# EAGLE design 7-keys (EAGLE 9.6.2)
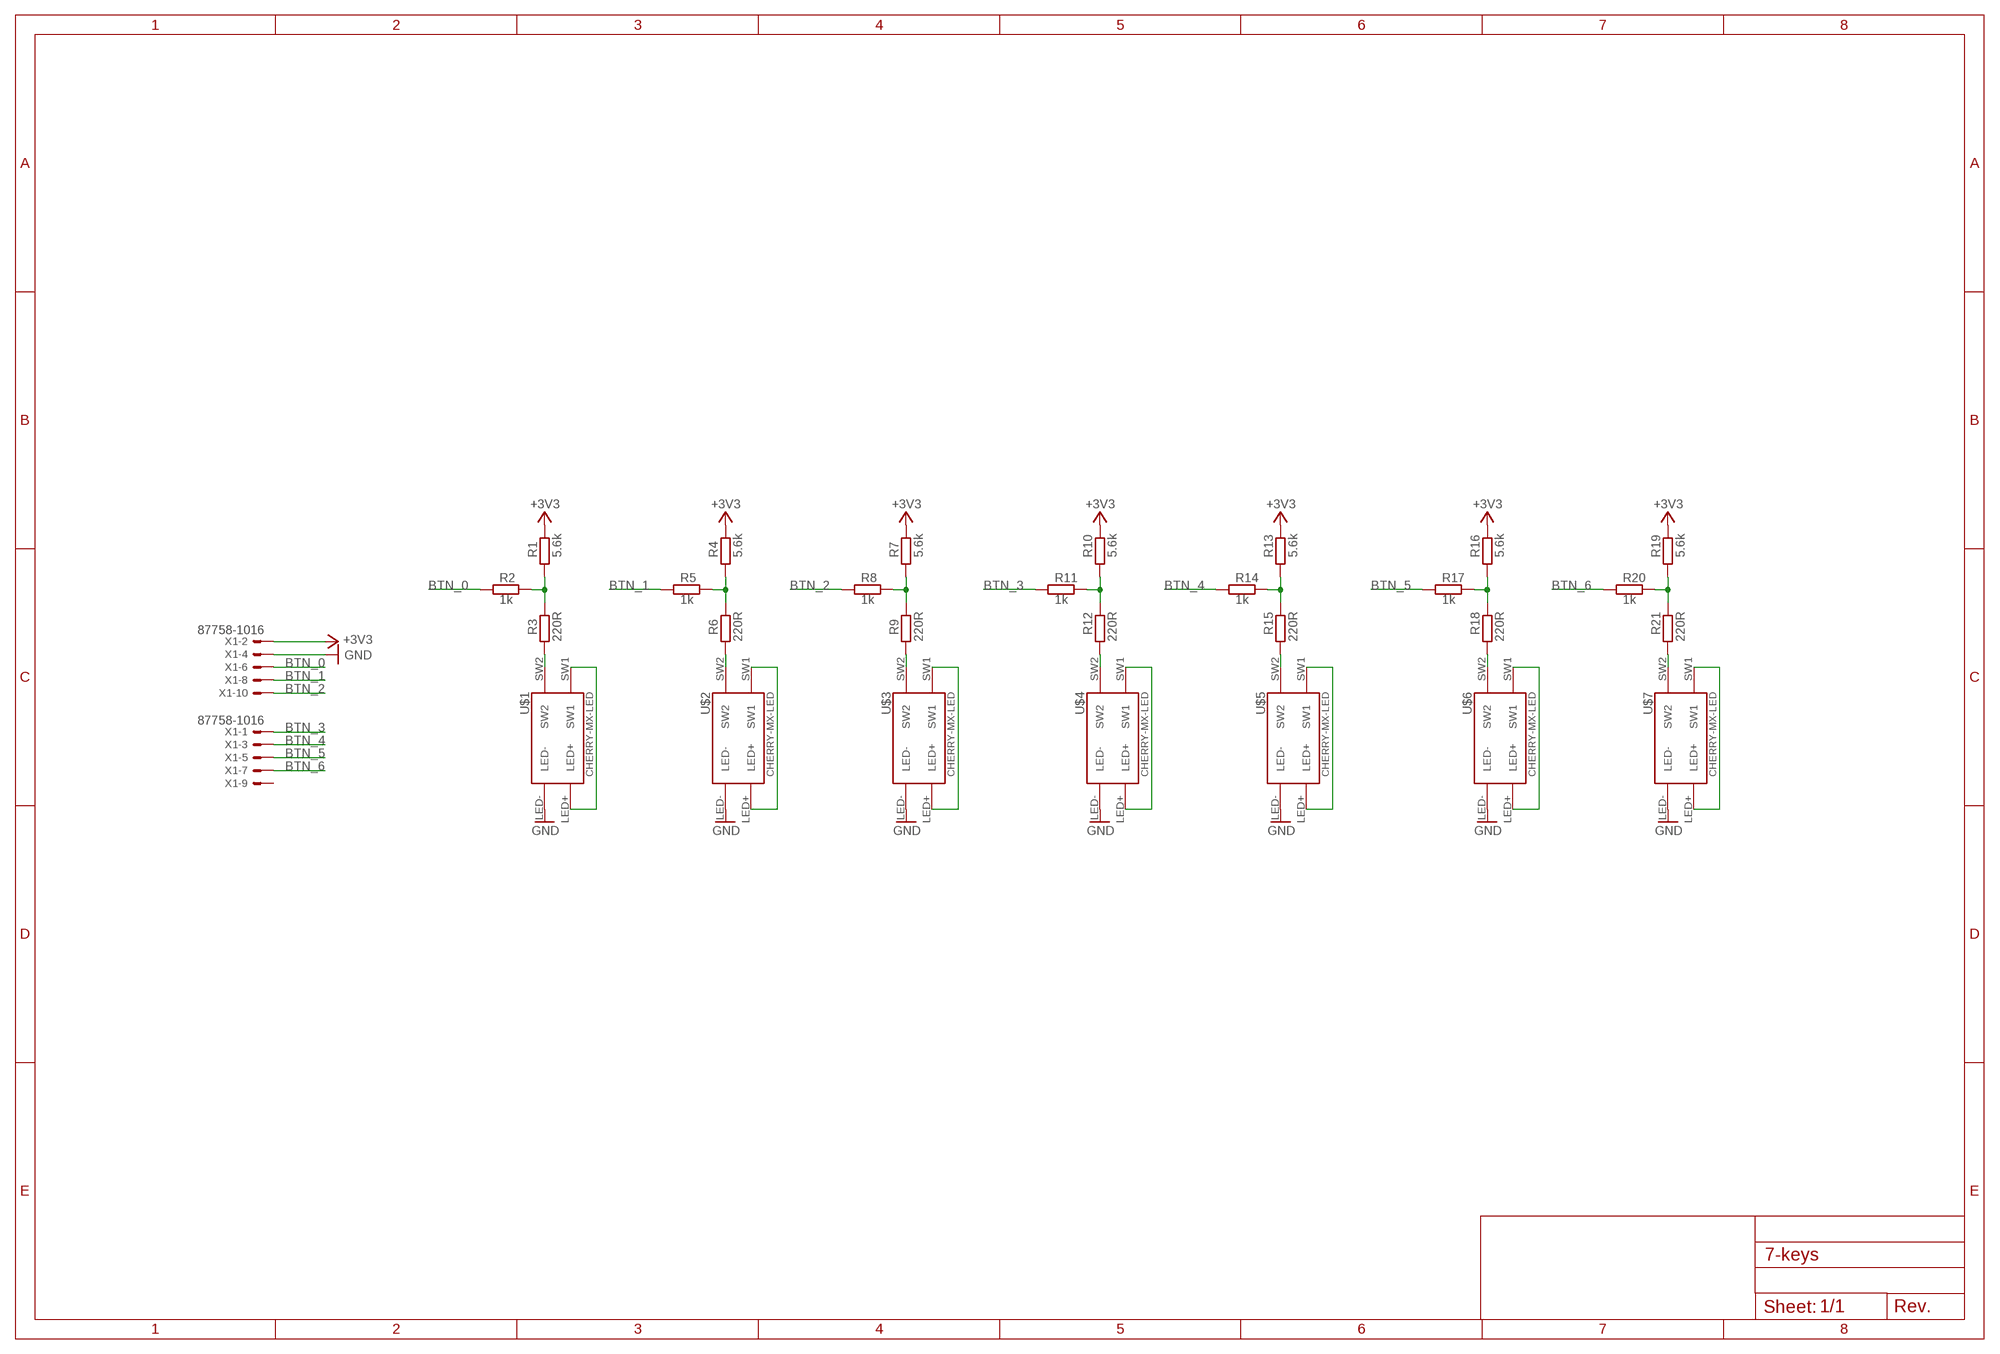
[diagram p0: schematic, sheet 1]

## Parts
R1  5.6k  RESISTOR  [R0603]
R2  1k  RESISTOR  [R0603]
R3  220R  RESISTOR  [R0603]
R4  5.6k  RESISTOR  [R0603]
R5  1k  RESISTOR  [R0603]
R6  220R  RESISTOR  [R0603]
R7  5.6k  RESISTOR  [R0603]
R8  1k  RESISTOR  [R0603]
R9  220R  RESISTOR  [R0603]
R10  5.6k  RESISTOR  [R0603]
R11  1k  RESISTOR  [R0603]
R12  220R  RESISTOR  [R0603]
R13  5.6k  RESISTOR  [R0603]
R14  1k  RESISTOR  [R0603]
R15  220R  RESISTOR  [R0603]
R16  5.6k  RESISTOR  [R0603]
R17  1k  RESISTOR  [R0603]
R18  220R  RESISTOR  [R0603]
R19  5.6k  RESISTOR  [R0603]
R20  1k  RESISTOR  [R0603]
R21  220R  RESISTOR  [R0603]
U$1  CHERRY-MX-LED  [CHERRY-MX-LED]
U$2  CHERRY-MX-LED  [CHERRY-MX-LED]
U$3  CHERRY-MX-LED  [CHERRY-MX-LED]
U$4  CHERRY-MX-LED  [CHERRY-MX-LED]
U$5  CHERRY-MX-LED  [CHERRY-MX-LED]
U$6  CHERRY-MX-LED  [CHERRY-MX-LED]
U$7  CHERRY-MX-LED  [CHERRY-MX-LED]
X1  87758-1016  [87758-1016]

## Nets
+3V3: R1.2 R4.2 R7.2 R10.2 R13.2 R16.2 R19.2 X1.2
BTN_0: R2.1 X1.6
BTN_1: R5.1 X1.8
BTN_2: R8.1 X1.10
BTN_3: R11.1 X1.1
BTN_4: R14.1 X1.3
BTN_5: R17.1 X1.5
BTN_6: R20.1 X1.7
GND: U$1.LED- U$2.LED- U$3.LED- U$4.LED- U$5.LED- U$6.LED- U$7.LED- X1.4
N$1: R1.1 R2.2 R3.2
N$2: R3.1 U$1.SW2
N$3: U$1.LED+ U$1.SW1
N$4: R4.1 R5.2 R6.2
N$5: R6.1 U$2.SW2
N$6: U$2.LED+ U$2.SW1
N$7: R7.1 R8.2 R9.2
N$8: R9.1 U$3.SW2
N$9: U$3.LED+ U$3.SW1
N$10: R10.1 R11.2 R12.2
N$11: R12.1 U$4.SW2
N$12: U$4.LED+ U$4.SW1
N$13: R13.1 R14.2 R15.2
N$14: R15.1 U$5.SW2
N$15: U$5.LED+ U$5.SW1
N$16: R16.1 R17.2 R18.2
N$17: R18.1 U$6.SW2
N$18: U$6.LED+ U$6.SW1
N$19: R19.1 R20.2 R21.2
N$20: R21.1 U$7.SW2
N$21: U$7.LED+ U$7.SW1
Unconnected: X1.9

## Library data of the parts
R1-R21 = lib:RESISTOR
U$1-U$7 = cherrymx:CHERRY-MX-LED: Cherry MX series keyswitch with LED
X1 = lib:87758-1016: 10 Pin - 2mm Dual Row Single Wafer, Vertical T/H HDR Source: http://www.molex.com/pdm_docs/sd/877580616_sd.pdf; MF: MOLEX; MPN: 87758-1016; OC_FARNELL: 7472340; OC_NEWARK: 59J1558

## Board
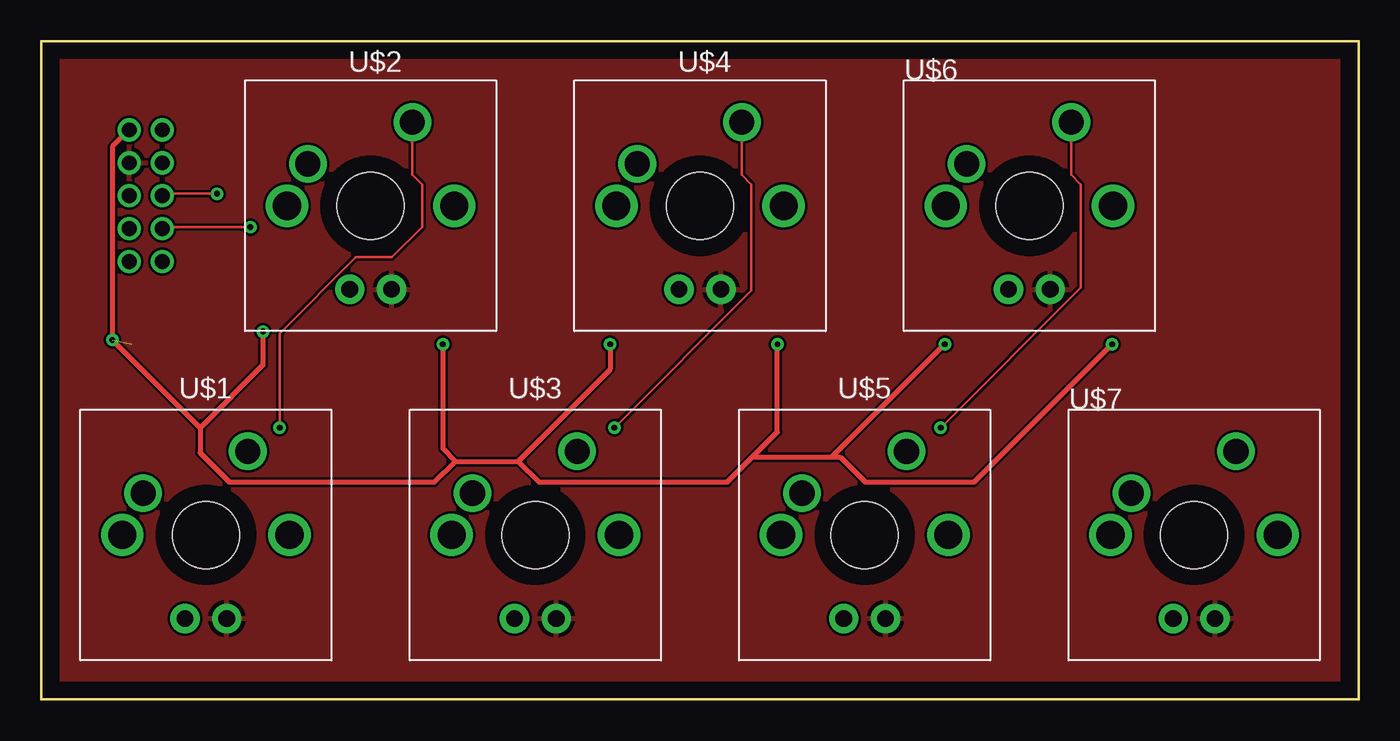
[diagram p1: board, top side]
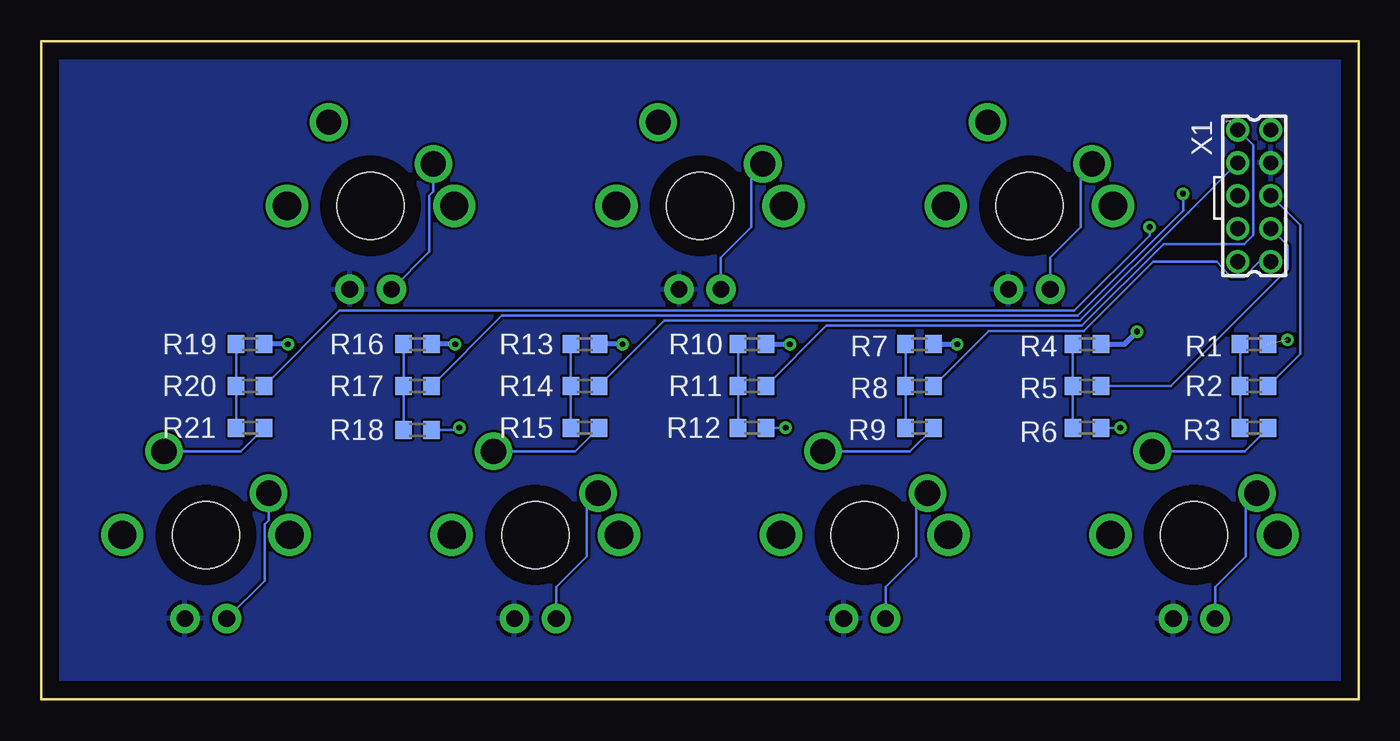
[diagram p2: board, bottom side, seen from below]

Size 80 x 40 mm. Coordinates in mm from the lower left corner, seen from the top.
Outline: 0,0 80,0 80,40 0,40 0,0
Copper layers (1*16): Top 0.035mm / dielectric 1.5mm / Bottom 0.035mm
Design rules "default": minimum track width 6mil, minimum drill 0.35mm, track to track 6mil, track to pad 6mil, pad to pad 6mil, via to via 6mil, smd to smd 6mil, copper to edge 40mil, drill to drill 6mil, minimum pad ring 10mil, minimum via ring 8mil, stop-mask expansion 4mil, vias tented up to drill 0mil, thermal gap 10mil

### Footprints (pad centres in the part's own frame; a part is rotated, then mirrored left to right if it is on the bottom)
R0603 = smd 1 x 1.1: 1 -0.85,0; 2 0.85,0
CHERRY-MX-LED = drill 1.016 pad 1.778: LED+ -1.27,-5.08; LED- 1.27,-5.08 | drill 1.714 pad 1.93: P$3 -5.08,0; P$4 5.08,0 | drill 1.524 pad 2.286: SW1 -3.81,2.54; SW2 2.54,5.08 | hole 4.064: 0,0
87758-1016 = drill 0.9 pad 1.27: 1 -4,-1; 2 -4,1; 3 -2,-1; 4 -2,1; 5 0,-1; 6 0,1; 7 2,-1; 8 2,1; 9 4,-1; 10 4,1

### Placement (x,y rotation side)
R1  6.35,21.59 0 bottom
R2  6.35,19.05 180 bottom
R3  6.35,16.51 180 bottom
R4  16.51,21.59 0 bottom
R5  16.51,19.05 180 bottom
R6  16.51,16.51 180 bottom
R7  26.67,21.59 0 bottom
R8  26.67,19.05 180 bottom
R9  26.67,16.51 180 bottom
R10  36.83,21.59 0 bottom
R11  36.83,19.05 180 bottom
R12  36.83,16.51 180 bottom
R13  46.99,21.59 0 bottom
R14  46.99,19.05 180 bottom
R15  46.99,16.51 180 bottom
R16  57.15,21.59 0 bottom
R17  57.15,19.05 180 bottom
R18  57.15,16.38 180 bottom
R19  67.31,21.59 0 bottom
R20  67.31,19.05 180 bottom
R21  67.31,16.51 180 bottom
U$1  10,10 0 top
U$2  20,30 0 top
U$3  30,10 0 top
U$4  40,30 0 top
U$5  50,10 0 top
U$6  60,30 0 top
U$7  70,10 0 top
X1  6.35,30.61 270 bottom

### Tracks (layer width: path | path; a pad name or v marks a point on that pad's centre or on a via)
+3V3  (via drill 0.35)  (1 unrouted)
  Top 0.305: 9.65,16.51 v4.32,21.84 4.32,33.58 X1.2 | 9.65,16.51 9.65,14.99 11.43,13.21 23.88,13.21 25.15,14.48 | 25.15,14.48 28.96,14.48 | 28.96,14.48 30.23,13.21 41.66,13.21 43.18,14.73 | 43.18,14.73 44.7,16.26 v44.7,21.59 | v13.46,22.35 13.46,20.32 9.65,16.51 | v24.38,21.59 24.38,15.24 25.15,14.48 | v34.54,21.59 34.54,20.07 28.96,14.48 | 43.18,14.73 48.01,14.73 | 48.01,14.73 48.51,14.73 50.04,13.21 56.64,13.21 v65.02,21.59 | v54.86,21.59 48.01,14.73
  Bottom 0.305: v44.7,21.59 R13.2 | R4.2 14.22,21.59 v13.46,22.35 | R7.2 v24.38,21.59 | R10.2 v34.54,21.59 | v54.86,21.59 R16.2 | v65.02,21.59 R19.2
BTN_0
  Bottom 0.152: R2.1 3.56,20.99 3.56,28.81 X1.6
BTN_1
  Bottom 0.152: R5.1 11.43,19.05 4.32,26.16 4.32,27.57 X1.8
BTN_2
  Bottom 0.152: R8.1 22.47,22.4 16.69,22.4 12.49,26.61 8.64,26.61 8.28,26.25 8.28,26.22 7.74,25.67 6.96,25.67 6.03,26.61 X1.10
BTN_3
  Bottom 0.152: X1.1 6.42,33.67 6.42,28.22 6.96,27.67 11.85,27.67 16.82,22.71 32.32,22.71 R11.1
BTN_4
  Bottom 0.152: X1.3 10.36,29.59 16.94,23.01 42.18,23.01 R14.1
BTN_5  (via drill 0.35)
  Top 0.152: v10.67,30.73 7.48,30.73 X1.5
  Bottom 0.152: v10.67,30.73 10.67,29.72 17.07,23.32 52.03,23.32 R17.1
BTN_6  (via drill 0.35)
  Top 0.152: v12.7,28.7 7.45,28.7 X1.7
  Bottom 0.152: R20.1 61.89,23.62 17.27,23.62 12.7,28.19 v12.7,28.7
GND
  pour Top: 0,39.88 79.94,39.88 79.94,0 0,0
  pour Bottom: 0,39.88 79.94,39.88 79.94,0 0,0
N$1
  Bottom 0.152: R3.2 R2.2 R1.1
N$2
  Bottom 0.152: R3.1 6.93,15.08 U$1.SW2
N$3
  Bottom 0.152: U$1.SW1 6.88,11.85 6.88,8.71 8.73,6.85 U$1.LED+
N$4
  Bottom 0.152: R4.1 R5.2 R6.2
N$5  (via drill 0.35)
  Top 0.152: U$2.SW2 22.54,31.88 23.12,31.29 23.12,28.71 21.29,26.88 19.11,26.88 14.48,22.25 v14.48,16.51
  Bottom 0.152: R6.1 v14.48,16.51
N$6
  Bottom 0.152: U$2.SW1 16.88,31.85 16.88,28.71 18.73,26.85 U$2.LED+
N$7
  Bottom 0.152: R9.2 R8.2 R7.1
N$8
  Bottom 0.152: R9.1 27.25,15.08 U$3.SW2
N$9
  Bottom 0.152: U$3.SW1 26.88,11.85 26.88,8.71 28.73,6.85 U$3.LED+
N$10
  Bottom 0.152: R10.1 R11.2 R12.2
N$11  (via drill 0.35)
  Top 0.152: U$4.SW2 42.54,31.88 43.12,31.29 43.12,24.84 v34.8,16.51
  Bottom 0.152: R12.1 v34.8,16.51
N$12
  Bottom 0.152: U$4.SW1 36.88,31.85 36.88,28.71 38.73,26.85 U$4.LED+
N$13
  Bottom 0.152: R15.2 R14.2 R13.1
N$14
  Bottom 0.152: R15.1 47.57,15.08 U$5.SW2
N$15
  Bottom 0.152: U$5.SW1 46.88,11.85 46.88,8.71 48.73,6.85 U$5.LED+
N$16
  Bottom 0.152: R16.1 R17.2 R18.2
N$17  (via drill 0.35)
  Top 0.152: U$6.SW2 62.54,31.88 63.12,31.29 63.12,25.02 v54.61,16.51
  Bottom 0.152: R18.1 54.74,16.38 v54.61,16.51
N$18
  Bottom 0.152: U$6.SW1 56.19,30.87 56.43,30.63 56.43,27.22 U$6.LED+
N$19
  Bottom 0.152: R19.1 R20.2 R21.2
N$20
  Bottom 0.152: R21.1 67.89,15.08 U$7.SW2
N$21
  Bottom 0.152: U$7.SW1 66.19,10.87 66.43,10.63 66.43,7.22 U$7.LED+